# Altium schematic sheet LPCB220 - CORE B.SchDoc
size A3; Address1: Factory 10; Address2: 9-13 Dingley Avenue, Dandeong, VICTORIA 3175, AUSTRALIA; DocumentNumber: 5; Revision: 1; SheetNumber: 5; SheetTotal: 18; Lockie__PCB_SUB_ASSEMBLY: Node Core B; Lockie__PCB_ASSEMBLY: Brake Control; Lockie__LDL: LPCB220; Lockie__PCB_DESCRIPTION: Redundant Stepper Node
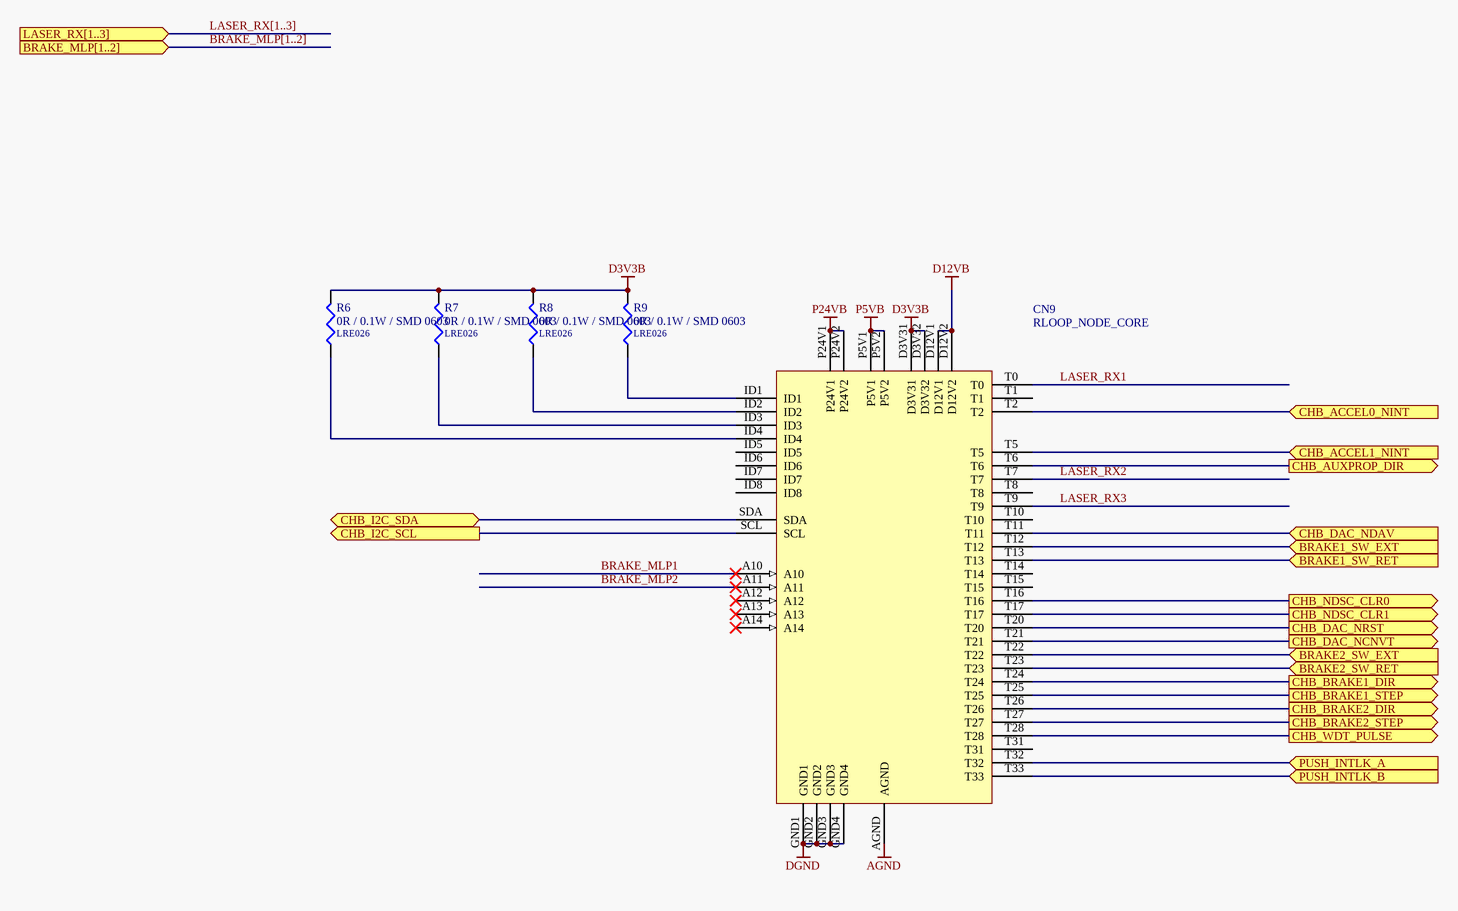
[diagram p0: LPCB220 - CORE B.SchDoc]

## Parts
CN9  RLOOP_NODE_CORE  [RLOOP_NODE_CORE]  (no BOM)
R6  0R / 0.1W / SMD 0603  LDL_NUMBER: LRE026  [LFP020__CR1608-0603-IPC7351_B]
R7  0R / 0.1W / SMD 0603  LDL_NUMBER: LRE026  [LFP020__CR1608-0603-IPC7351_B]
R8  0R / 0.1W / SMD 0603  LDL_NUMBER: LRE026  [LFP020__CR1608-0603-IPC7351_B]
R9  0R / 0.1W / SMD 0603  LDL_NUMBER: LRE026  [LFP020__CR1608-0603-IPC7351_B]

## Ports
BRAKE1_SW_EXT (in), BRAKE1_SW_RET (in), BRAKE2_SW_EXT (in), BRAKE2_SW_RET (in), BRAKE_MLP[1..2] (in), CHB_ACCEL0_NINT (in), CHB_ACCEL1_NINT (in), CHB_AUXPROP_DIR (out), CHB_BRAKE1_DIR (out), CHB_BRAKE1_STEP (out), CHB_BRAKE2_DIR (out), CHB_BRAKE2_STEP (out), CHB_DAC_NCNVT (out), CHB_DAC_NDAV (in), CHB_DAC_NRST (out), CHB_I2C_SCL (out), CHB_I2C_SDA (bidir), CHB_NDSC_CLR0 (out), CHB_NDSC_CLR1 (out), CHB_WDT_PULSE (out), LASER_RX[1..3] (in), PUSH_INTLK_A (in), PUSH_INTLK_B (in)

## Nets
AGND: CN9.AGND
D3V3B: CN9.D3V31 CN9.D3V32 R6.2 R7.2 R8.2 R9.2
D12VB: CN9.D12V1 CN9.D12V2
DGND: CN9.GND1 CN9.GND2 CN9.GND3 CN9.GND4
P5VB: CN9.P5V1 CN9.P5V2
P24VB: CN9.P24V1 CN9.P24V2
BRAKE1_SW_EXT: CN9.T12 ; port BRAKE1_SW_EXT
BRAKE1_SW_RET: CN9.T13 ; port BRAKE1_SW_RET
BRAKE2_SW_EXT: CN9.T22 ; port BRAKE2_SW_EXT
BRAKE2_SW_RET: CN9.T23 ; port BRAKE2_SW_RET
BRAKE_MLP1: CN9.A10
BRAKE_MLP2: CN9.A11
CHB_ACCEL0_NINT: CN9.T2 ; port CHB_ACCEL0_NINT
CHB_ACCEL1_NINT: CN9.T5 ; port CHB_ACCEL1_NINT
CHB_AUXPROP_DIR: CN9.T6 ; port CHB_AUXPROP_DIR
CHB_BRAKE1_DIR: CN9.T24 ; port CHB_BRAKE1_DIR
CHB_BRAKE1_STEP: CN9.T25 ; port CHB_BRAKE1_STEP
CHB_BRAKE2_DIR: CN9.T26 ; port CHB_BRAKE2_DIR
CHB_BRAKE2_STEP: CN9.T27 ; port CHB_BRAKE2_STEP
CHB_DAC_NCNVT: CN9.T21 ; port CHB_DAC_NCNVT
CHB_DAC_NDAV: CN9.T11 ; port CHB_DAC_NDAV
CHB_DAC_NRST: CN9.T20 ; port CHB_DAC_NRST
CHB_I2C_SCL: CN9.SCL ; port CHB_I2C_SCL
CHB_I2C_SDA: CN9.SDA ; port CHB_I2C_SDA
CHB_NDSC_CLR0: CN9.T16 ; port CHB_NDSC_CLR0
CHB_NDSC_CLR1: CN9.T17 ; port CHB_NDSC_CLR1
CHB_WDT_PULSE: CN9.T28 ; port CHB_WDT_PULSE
LASER_RX1: CN9.T0
LASER_RX2: CN9.T7
LASER_RX3: CN9.T9
PUSH_INTLK_A: CN9.T32 ; port PUSH_INTLK_A
PUSH_INTLK_B: CN9.T33 ; port PUSH_INTLK_B
NetCN9_ID1: CN9.ID1 R9.1
NetCN9_ID2: CN9.ID2 R8.1
NetCN9_ID3: CN9.ID3 R7.1
NetCN9_ID4: CN9.ID4 R6.1

Not connected (* = marked no-connect by the designer): CN9 A12* A13* A14* ID5 ID6 ID7 ID8 T1 T8 T10 T14 T15 T31

## Buses and harness runs
bus BRAKE_MLP[1..2] = port BRAKE_MLP[1..2]
bus LASER_RX[1..3] = port LASER_RX[1..3]

## Notes on the sheet
- PCB COMPONENT DESCRIPTION
- LDL NUMBER
- Assembly Details
- Size
- Drawing File Name
- Revision
- http://rloop.org
- Scale
- A3
- Sheet Details
- N.T.S
- Sheet:
- Of:

## Library data of the parts
CN9 = RLOOP_NODE_CORE: rLoop Node Core Connector; FMEDA__CHANNEL: COM; FMEDA__OPERATING__CURRENT_MAX: 0; FMEDA__OPERATING__TEMP_MAX: 50; FMEDA__OPERATING__TEMP_MIN: -20; FMEDA__OPERATING__TEMP_TYP: 27; FMEDA__OPERATING__VOLTAGE_MAX: 16; FMEDA__OPERATING__VOLTAGE_TYP: 12; FMEDA__OPERATING__CURRENT_MIN: 0; FMEDA__OPERATING__CURRENT_TYP: 0; FMEDA__OPERATING__VOLTAGE_MIN: 0
R6-R9 = 0R / 0.1W / SMD 0603: Resistor, Ceramic Chip, 0R, 0.1W, SMD 0603 [LRE026]; Value: 0; FMEDA__OPERATING__TEMP_MAX: 50; FMEDA__OPERATING__TEMP_MIN: -20; FMEDA__OPERATING__TEMP_TYP: 27; FMEDA__CHANNEL: COM; FMEDA__OPERATING__POWER_MAX: 0; FMEDA__OPERATING__POWER_MIN: 0; FMEDA__OPERATING__VOLTAGE_MAX: 0; FMEDA__OPERATING__VOLTAGE_MIN: 0; FMEDA__OPERATING__VOLTAGE_TYP: 0; FMEDA__FUNCTION_IN_SYSTEM: *